# EAGLE design LCD-Input_Module (EAGLE 9.6.2)

## Sheet 1 of 2
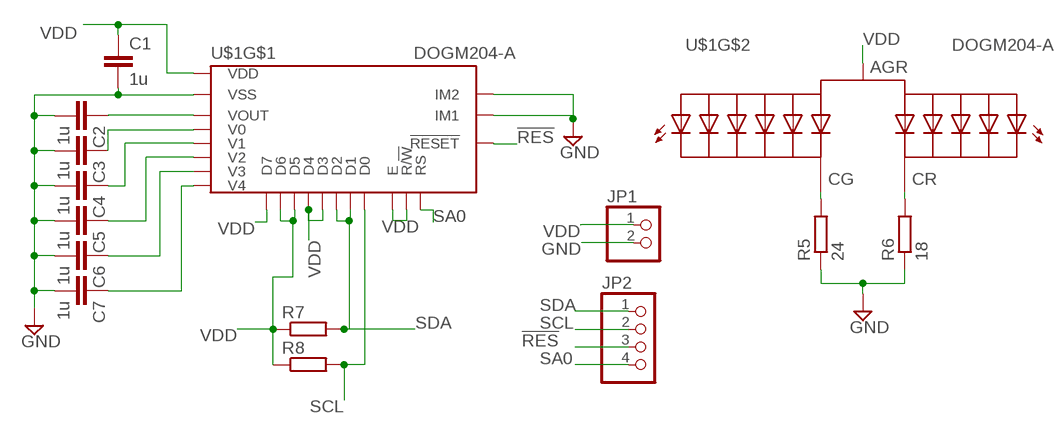
[diagram p0: schematic, sheet 1]

### Parts
C1  1u  C-EUC0603  [C0603]
C2  1u  C-EUC0603  [C0603]
C3  1u  C-EUC0603  [C0603]
C4  1u  C-EUC0603  [C0603]
C5  1u  C-EUC0603  [C0603]
C6  1u  C-EUC0603  [C0603]
C7  1u  C-EUC0603  [C0603]
JP1  PINHD-1X2  [1X02]
JP2  PINHD-1X4  [1X04]
R5  24  R-EU_R0603  [R0603]
R6  18  R-EU_R0603  [R0603]
R7  R-EU_R0603  [R0603]
R8  R-EU_R0603  [R0603]
U$1  DOGM204-A  [LCD]

### Nets
!RES: JP2.3 U$1.P$44(!RESET)
GND: C1.2 C2.2 C3.2 C4.2 C5.2 C6.2 C7.2 JP1.2 R5.1 R6.1 U$1.P$29(IM2) U$1.P$30(IM1) U$1.P$32(VSS) ; also sheet 2
N$4: C3.1 U$1.P$24(V0)
N$5: C6.1 U$1.P$27(V3)
N$6: C4.1 U$1.P$25(V1)
N$7: C5.1 U$1.P$26(V2)
N$9: C7.1 U$1.P$28(V4)
N$11: C2.1 U$1.P$23(VOUT)
N$15: R5.2 U$1.P$21(CG)
N$19: R6.2 U$1.P$22(CR)
SA0: JP2.4 U$1.P$43(RS)
SCL: JP2.2 R8.2 U$1.P$40(D0)
SDA: JP2.1 R7.2 U$1.P$38(D2) U$1.P$39(D1)
VDD: C1.1 JP1.1 R7.1 R8.1 U$1.P$1(AGR) U$1.P$31(VDD) U$1.P$33(D7) U$1.P$34(D6) U$1.P$35(D5) U$1.P$36(D4) U$1.P$37(D3) U$1.P$41(E) U$1.P$42(R/!W) ; also sheet 2

## Sheet 2 of 2
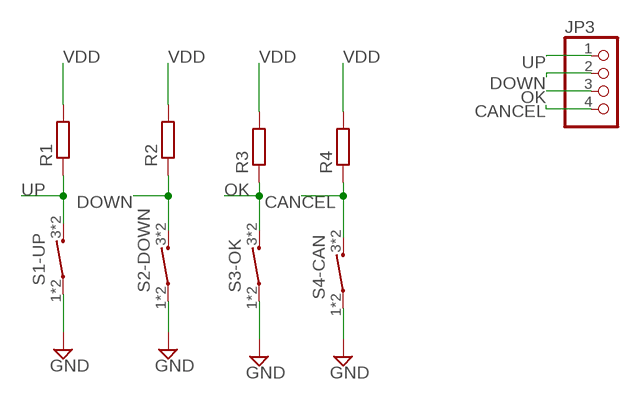
[diagram p1: schematic, sheet 2]

### Parts
JP3  PINHD-1X4  [1X04]
R1  R-EU_R0603  [R0603]
R2  R-EU_R0603  [R0603]
R3  R-EU_R0603  [R0603]
R4  R-EU_R0603  [R0603]
S1-UP  PTS647  [PTS647-TACTSWITCH]
S2-DOWN  PTS647  [PTS647-TACTSWITCH]
S3-OK  PTS647  [PTS647-TACTSWITCH]
S4-CAN  PTS647  [PTS647-TACTSWITCH]

### Nets
CANCEL: JP3.4 R4.1 S4-CAN.3 S4-CAN.4
DOWN: JP3.2 R2.1 S2-DOWN.3 S2-DOWN.4
GND: S1-UP.1 S1-UP.2 S2-DOWN.1 S2-DOWN.2 S3-OK.1 S3-OK.2 S4-CAN.1 S4-CAN.2 ; also sheet 1
OK: JP3.3 R3.1 S3-OK.3 S3-OK.4
UP: JP3.1 R1.1 S1-UP.3 S1-UP.4
VDD: R1.2 R2.2 R3.2 R4.2 ; also sheet 1

## Library data of the parts
C1-C7 = rcl:C-EU: CAPACITOR, European symbol; SPICEPREFIX: C
JP1 = pinhead:PINHD-1X2: PIN HEADER
JP2 JP3 = pinhead:PINHD-1X4: PIN HEADER
R1-R8 = rcl:R-EU_: RESISTOR, European symbol; SPICEPREFIX: R
S1-UP S2-DOWN S3-OK S4-CAN = Pump_Component:PTS647: Four terminal ON/OFF mechanical tactil switch Supporting Material: PTS647 Datasheet <https://www.mouser.de/datasheet/2/60/pts647-1841803.pdf>
U$1 = Pump_Component:DOGM204-A

## Net classes
0 default: clearance 0.2 mm

## Board
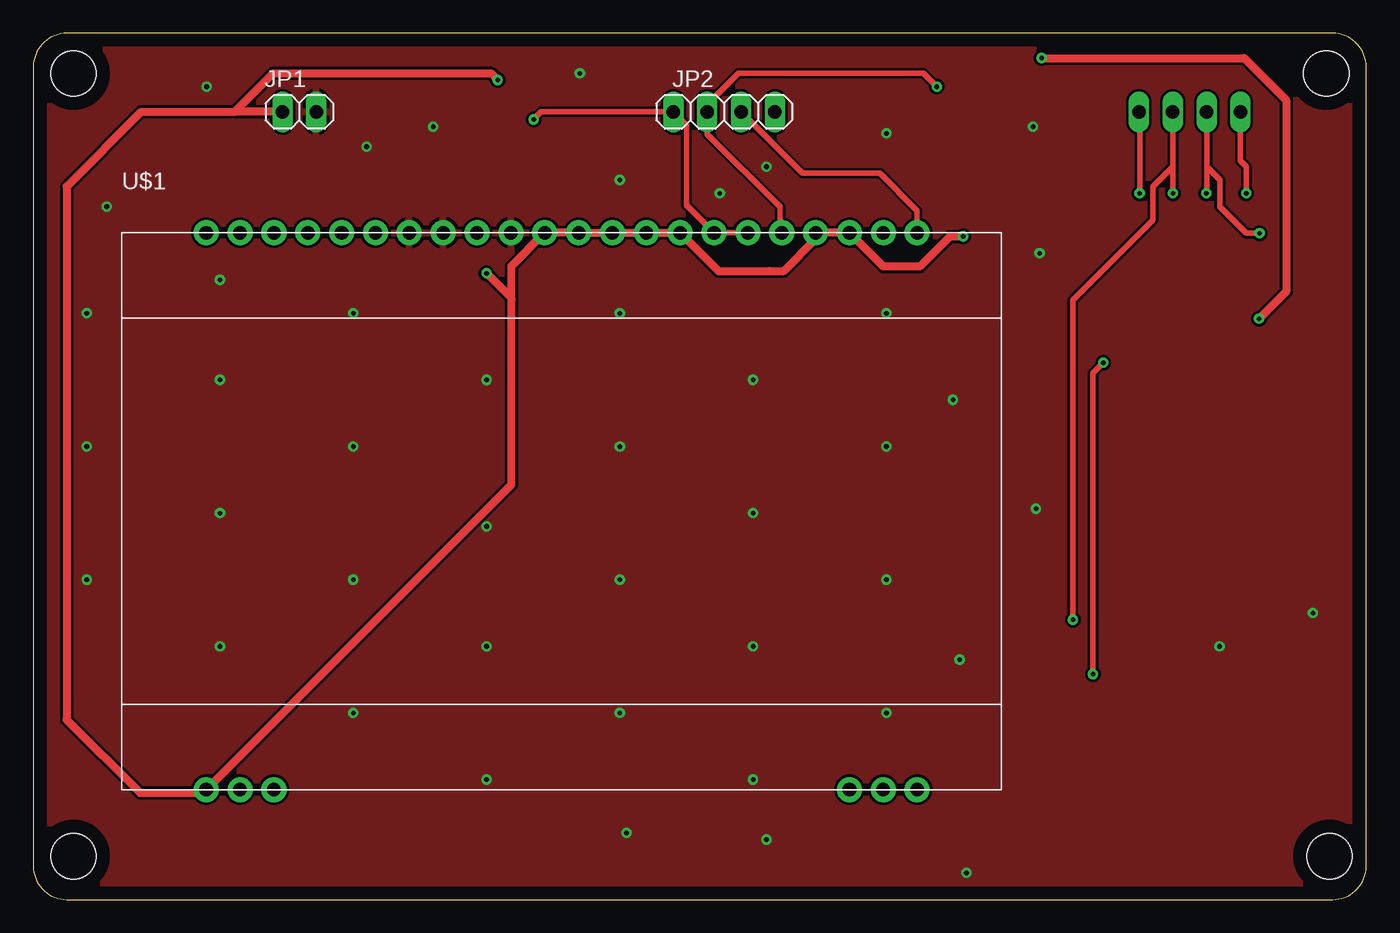
[diagram p2: board, top side]
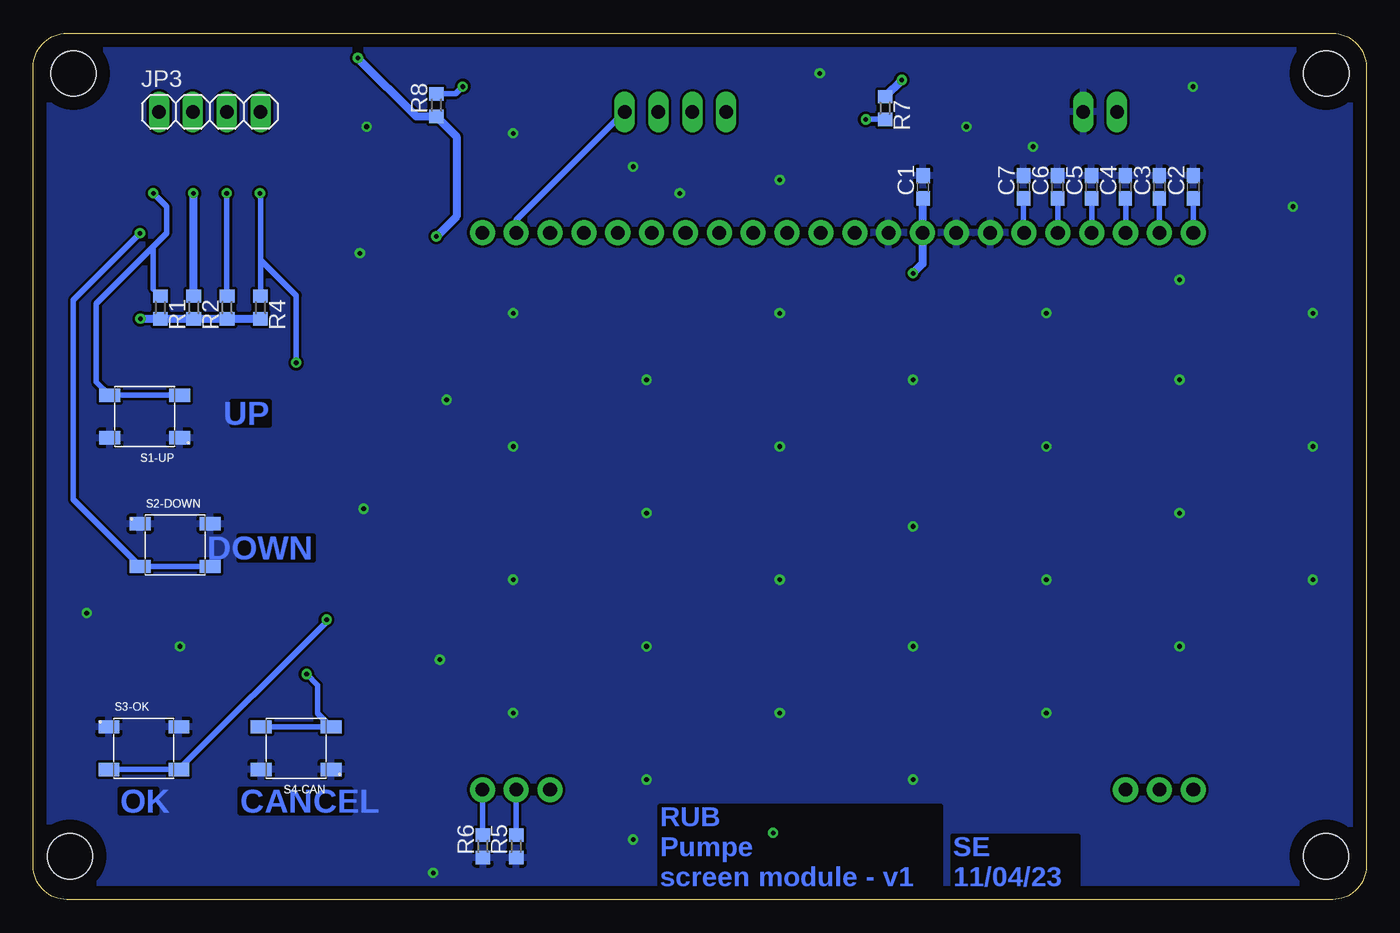
[diagram p3: board, bottom side, seen from below]

Size 100 x 65 mm. Coordinates in mm from the lower left corner, seen from the top.
Outline: 0,62.5 0,2.5 arc90 2.5,0 97.5,0 arc90 100,2.5 100,62.5 arc90 97.5,65 2.5,65 arc90 0,62.5
Copper layers (1*16): Top 0.035mm / dielectric 1.5mm / Bottom 0.035mm
Design rules "default": minimum track width 6mil, minimum drill 0.35mm, track to track 6mil, track to pad 6mil, pad to pad 6mil, via to via 6mil, smd to smd 6mil, copper to edge 40mil, drill to drill 6mil, minimum pad ring 10mil, minimum via ring 8mil, stop-mask expansion 4mil, vias tented up to drill 0mil, thermal gap 10mil
Holes 3.4 mm at 3,62 97,62 97.25,3.25 3.02,3.25

### Footprints (pad centres in the part's own frame; a part is rotated, then mirrored left to right if it is on the bottom)
C0603 = smd 1.1 x 1: 1 -0.85,0; 2 0.85,0
1X02 = drill 1.016 long: 1 -1.27,0; 2 1.27,0
1X04 = drill 1.016 long: 1 -3.81,0; 2 -1.27,0; 3 1.27,0; 4 3.81,0
R0603 = smd 1 x 1.1: 1 -0.85,0; 2 0.85,0
PTS647-TACTSWITCH = smd 1.55 x 1: 1 -2.625,1.6; 2 2.625,1.6; 3 -2.625,-1.6; 4 2.625,-1.6
LCD = drill 1.016 pad 1.88: P$1 -26.67,-20.9; P$2 -24.13,-20.9; P$3 -21.59,-20.9; P$20 21.59,-20.9; P$21 24.13,-20.9; P$22 26.67,-20.9; P$23 -26.67,20.9; P$24 -24.13,20.9; P$25 -21.59,20.9; P$26 -19.05,20.9; P$27 -16.51,20.9; P$28 -13.97,20.9; P$29 -11.43,20.9; P$30 -8.89,20.9; P$31 -6.35,20.9; P$32 -3.81,20.9; P$33 -1.27,20.9; P$34 1.27,20.9; P$35 3.81,20.9; P$36 6.35,20.9; P$37 8.89,20.9; P$38 11.43,20.9; P$39 13.97,20.9; P$40 16.51,20.9; P$41 19.05,20.9; P$42 21.59,20.9; P$43 24.13,20.9; P$44 26.67,20.9

### Placement (x,y rotation side)
C1  33.24,53.47 90 bottom
C2  12.97,53.47 90 bottom
C3  15.52,53.47 90 bottom
C4  18.06,53.47 90 bottom
C5  20.61,53.47 90 bottom
C6  23.16,53.47 90 bottom
C7  25.7,53.47 90 bottom
JP1  19.96,59.11 0 top
JP2  51.83,59.11 0 top
JP3  86.76,59.11 0 bottom
R1  90.47,44.43 270 bottom
R2  87.96,44.43 270 bottom
R3  85.46,44.43 270 bottom
R4  82.96,44.43 270 bottom
R5  63.77,4 90 bottom
R6  66.27,4 90 bottom
R7  36.1,59.39 270 bottom
R8  69.76,59.61 90 bottom
S1-UP  91.64,36.24 180 bottom
S2-DOWN  89.36,26.6 0 bottom
S3-OK  91.71,11.36 0 bottom
S4-CAN  80.28,11.36 180 bottom
U$1  39.64,29.14 0 top

### Tracks (layer width: path | path; a pad name or v marks a point on that pad's centre or on a via)
!RES
  Top 0.4: 55.1,57.1 57.71,54.5 63.5,54.5 66.31,51.69 U$1.P$44
  Top 0.406: JP2.3 55.1,57.1
CANCEL  (via drill 0.35)
  Top 0.4: v80.28,40.28 79.5,39.5
  Top 0.406: JP3.4 83,59.06 v83,53 | 79.5,39.5 v79.5,16.91
  Bottom 0.4: v79.5,16.91 78.66,16.07 78.66,13.96 S4-CAN.3 S4-CAN.4
  Bottom 0.406: R4.1 82.96,48 | 82.96,48 82.96,52.96 v83,53 | v80.28,40.28 80.28,45.32 82.96,48
DOWN  (via drill 0.35)
  Top 0.406: JP3.2 88.03,55 | 88.03,55 88.03,53.03 v88,53 | 88.03,55 89,54.03 89,52 91,50 v92,50
  Bottom 0.4: S2-DOWN.4 S2-DOWN.3
  Bottom 0.406: v92,50 97,45 97,30.02 S2-DOWN.3
  Bottom 0.61: v88,53 88,45.32 R2.1
GND  (via drill 0.35)
  other vias: 5.5,52 89,19 4,24 4,34 4,44 14,19 14,29 14,39 14,46.5 13,61 24,14 24,24 24,34 24,44 25,56.5 55,4.5 44,24 44,34 44,44 44,54 30,58 34,39 34,28 34,19 54,29 54,39 96,21.5 55,55 64,34 64,44 64,57.5 51.5,53 69,37.5 70,2 41,62 69.5,18 75.22,29.32 75.5,48.5 75,58 64,24 64,14 54,19 54,9 34,9 44.5,5 44,14
  pour Top: -1,66 -1,0 0,-1 99,-1 101,1 101,65 100,66
  pour Bottom: -1,66 -1,0 0,-1 99,-1 101,1 101,65 100,66
N$4
  Bottom 0.406: C3.1 U$1.P$24
N$5
  Bottom 0.406: U$1.P$27 23.13,52.59 C6.1
N$6
  Bottom 0.406: U$1.P$25 18.05,52.61 C4.1
N$7
  Bottom 0.406: U$1.P$26 20.59,52.6 C5.1
N$9
  Bottom 0.406: C7.1 25.7,50.07 U$1.P$28
N$11
  Bottom 0.406: C2.1 U$1.P$23
N$15
  Bottom 0.4: U$1.P$21 R5.2
N$19
  Bottom 0.4: U$1.P$22 66.31,4.88 R6.2
OK  (via drill 0.35)
  Top 0.406: JP3.3 85.5,55 | 85.5,55 v85.5,53 | v78,21 78,45 84,51 84,53.5 85.5,55
  Bottom 0.4: S3-OK.3 S3-OK.4
  Bottom 0.406: S3-OK.4 78,20.84 v78,21 | v85.5,53 85.5,45.32 85.49,45.31 R3.1
SA0
  Bottom 0.406: JP2.4 63.77,50.98 U$1.P$43
SCL  (via drill 0.35)
  Top 0.4: 56,52 50.56,57.44 JP2.2 50.56,59.64 52.92,62 66.78,62 v67.78,61
  Top 0.406: 56,52 56,50.19 U$1.P$40
  Bottom 0.406: R8.2 68.32,60.46 v67.78,61
SDA  (via drill 0.35)
  Top 0.4: JP2.1 48,59.11 38.11,59.11 v37.54,58.54 | U$1.P$39 U$1.P$38
  Top 0.406: U$1.P$38 49,52.11 49,58.11 48,59.11
  Bottom 0.4: R7.2 v37.54,58.54
UP  (via drill 0.35)
  Top 0.406: JP3.1 90.57,55.43 91,55 v91,53
  Bottom 0.305: R1.1 91,45.81
  Bottom 0.4: S1-UP.3 S1-UP.4
  Bottom 0.406: v91,53 90,52 90,50 91,49 | 91,45.81 91,49 | S1-UP.4 95.27,38.84 95.27,44.73 91,49
VDD  (via drill 0.35)
  Top 0.6: 35.87,47.54 35.87,45 35.87,31.14 U$1.P$1 12.73,8 8,8 2.5,13.5 2.5,53.5 8.11,59.11 15,59.11 JP1.1 | U$1.P$34 U$1.P$35 | U$1.P$42 U$1.P$41 58.69,49.54 56.33,47.17 55.25,47.17 55.23,47.15 51.42,47.15 U$1.P$37 U$1.P$36 | v91.97,43.58 94,45.62 94,60 90.85,63.15 v75.65,63.15
  Top 0.61: v69.76,49.76 68.76,49.76 66.5,47.5 63.77,47.5 U$1.P$42 | 15,59.11 15.11,59.11 18,62 34.34,62 v34.84,61.5 | U$1.P$35 U$1.P$36 | 35.87,47.54 U$1.P$33 U$1.P$34 | v34,47 35.87,45.13 35.87,45
  Bottom 0.6: v34.84,61.5 R7.1 | R4.2 R3.2 R2.2 R1.2 v91.97,43.58 | v75.65,63.15 71.26,58.76 R8.1 68.26,57.26 68.26,51.26 v69.76,49.76
  Bottom 0.61: v34,47 33.29,47.71 U$1.P$31 33.24,50.09 C1.1

### Text on the board
Bottom: UP | DOWN | CANCEL | OK | SE / 11/04/23 | RUB / Pumpe / screen module - v1